# Altium schematic sheet PV_BMS_IO.SchDoc
size A
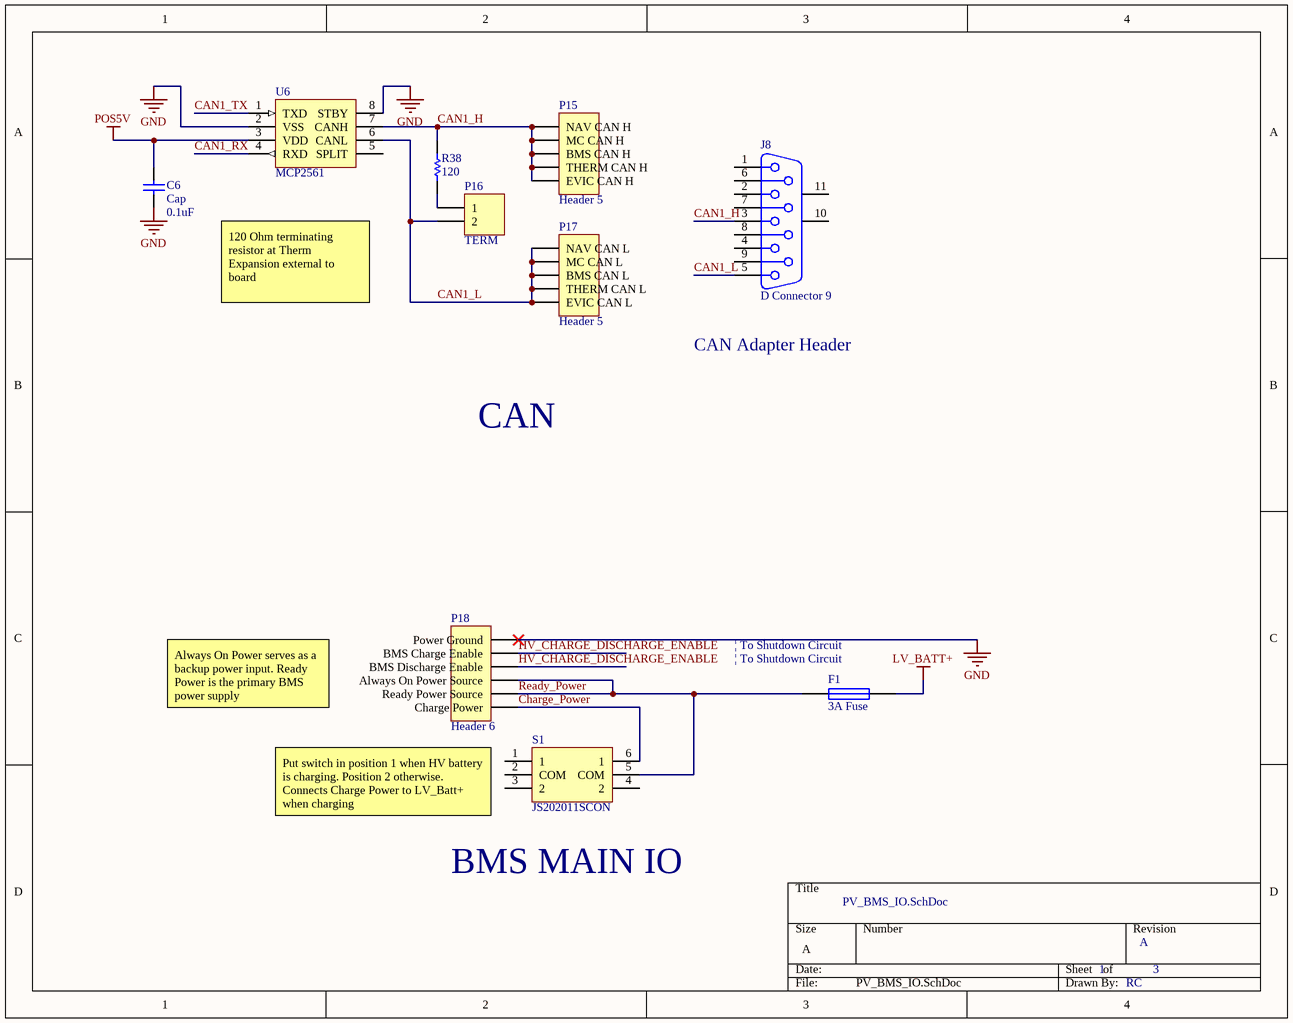
[diagram p0: PV_BMS_IO.SchDoc]

## Parts
C6  Cap  value 0.1uF  [1206]
F1  3A Fuse  [1A FUSE HOLDER]
J8  D Connector 9  [DSUB1.385-2H9]
P15  Header 5  [5POS TERM BLOCK]
P16  TERM  [HDR1X2]
P17  Header 5  [5POS TERM BLOCK]
P18  Header 6  [6POS TERM BLOCK]
R38  value 120  [1206]  (hidden comment: Res1)
S1  JS202011SCON  [JS202011SCON]
U6  MCP2561  [8-SOIC]

## Nets
GND: C6.1 P18.6(Power_Ground) U6.2(VSS) U6.8(STBY)
LV_BATT+: F1.2
POS5V: C6.2 U6.3(VDD)
CAN1_H: J8.3 P15.1(NAV_CAN_H) P15.2(MC_CAN_H) P15.3(BMS_CAN_H) P15.4(THERM_CAN_H) P15.5(EVIC_CAN_H) R38.2 U6.7(CANH)
CAN1_L: J8.5 P16.2 P17.1(NAV_CAN_L) P17.2(MC_CAN_L) P17.3(BMS_CAN_L) P17.4(THERM_CAN_L) P17.5(EVIC_CAN_L) U6.6(CANL)
CAN1_RX: U6.4(RXD)
CAN1_TX: U6.1(TXD)
Charge_Power: P18.1(Charge_Power) S1.6(1)
HV_CHARGE_DISCHARGE_ENABLE: P18.4(BMS_Discharge_Enable) P18.5(BMS_Charge_Enable)
Ready_Power: F1.1 P18.2(Ready_Power_Source) P18.3(Always_On_Power_Source) S1.5(COM)
NetP16_1: P16.1 R38.1

Not connected (* = marked no-connect by the designer): J8 1 2 4 6 7 8 9 10(MH1) 11(MH2); S1 1 2(COM) 3(2) 4(2); U6 5(SPLIT)

## Notes on the sheet
- 120 Ohm terminating resistor at Therm Expansion external to board
- CAN Adapter Header
- CAN
- Always On Power serves as a backup power input. Ready Power is the primary BMS power supply
- (near F1) | To Shutdown Circuit
- Put switch in position 1 when HV battery is charging. Position 2 otherwise.                   Connects Charge Power to LV_Batt+ when charging
- BMS MAIN IO
- PV_BMS_IO.SchDoc
- 1
- A
- 3
- RC

## Library data of the parts
C6 = Cap: Capacitor; Published: 8-Jun-2000; LatestRevisionDate: 17-Jul-2002; LatestRevisionNote: Re-released for DXP Platform.; PackageReference: RAD-0.3; Publisher: Altium Limited; PackageDescription: Radial Cap, Thru-Hole; 2 Leads; 0.3 in Pin Spacing
F1 = Fuse 1: Fuse; Published: 8-Jun-2000; LatestRevisionDate: 17-Jul-2002; LatestRevisionNote: Re-released for DXP Platform.; PackageReference: PIN-W2/E2.8; Publisher: Altium Limited; PackageDescription: Thru-Hole; 2 Leads; ComponentLink1Description: Digikey; ComponentLink1URL: F1226CT-ND
J8 = D Connector 9: Receptacle Assembly, 9 Position, Right Angle; PackageDocument: O; Positions: 9; Published: 15-Jun-2001; LatestRevisionDate: 17-Jul-2002; LatestRevisionNote: Re-released for DXP Platform.; DatasheetDocument: 1-Sep-1999; PackageReference: 788750; Publisher: Altium Limited; Orientation: Right Angle; Gender: Receptacle
P15 P17 = Header 5: Header, 5-Pin; LatestRevisionDate: 17-Jul-2002; LatestRevisionNote: Re-released for DXP Platform.; Publisher: Altium Limited
P16 = Header 2: Header, 2-Pin; LatestRevisionDate: 17-Jul-2002; LatestRevisionNote: Re-released for DXP Platform.; Publisher: Altium Limited
P18 = Header 6: Header, 6-Pin; LatestRevisionDate: 17-Jul-2002; LatestRevisionNote: Re-released for DXP Platform.; Publisher: Altium Limited
R38 = Res1: Resistor; Published: 8-Jun-2000; LatestRevisionDate: 17-Jul-2002; LatestRevisionNote: Re-released for DXP Platform.; PackageReference: AXIAL-0.3; Publisher: Altium Limited; PackageDescription: Axial Device, Thru-Hole; 2 Leads; 0.3 in Pin Spacing
S1 = JS202011SCON: DPST Switch; ComponentLink1Description: Digikey; ComponentLink1URL: https://www.digikey.com/product-detail/en/c-k/JS202011SCQN/401-2002-1-ND/1640098
U6 = MCP2561: CAN Transciever; ComponentLink1Description: Part; ComponentLink1URL: https://www.digikey.com/product-detail/en/microchip-technology/MCP2561-E-SN/MCP2561-E-SN-ND/4079961; ComponentLink2Description: Datasheet; ComponentLink2URL: http://ww1.microchip.com/downloads/en/DeviceDoc/20005167C.pdf